# Altium schematic sheet USB.SchDoc
size A3; DocumentNumber: 16; SheetNumber: 18; SheetTotal: 19
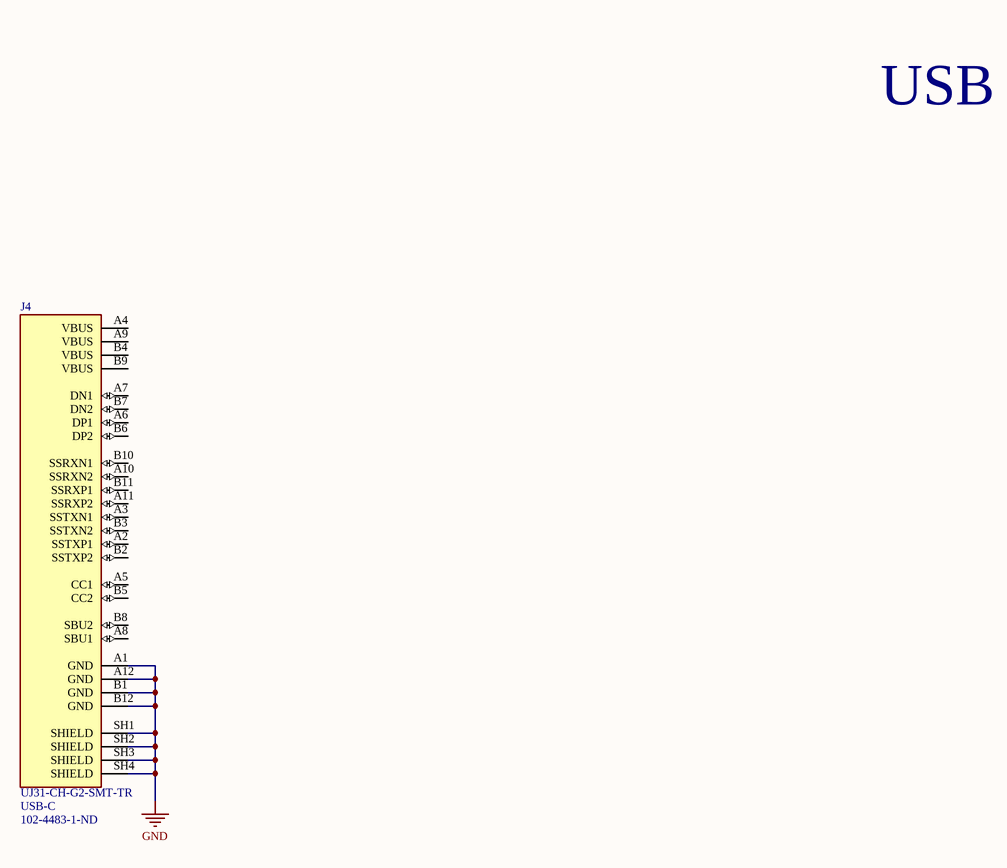
[diagram p0: USB.SchDoc]

## Parts
J4  UJ31-CH-G2-SMT-TR  Connector Type: USB-C  Supplier Part Number 1: 102-4483-1-ND  [UJ31-CH-G2-SMT-TR]

## Nets
GND: J4.A1(GND) J4.A12(GND) J4.B1(GND) J4.B12(GND) J4.SH1(SHIELD) J4.SH2(SHIELD) J4.SH3(SHIELD) J4.SH4(SHIELD)

Not connected (* = marked no-connect by the designer): J4 A2(SSTXP1) A3(SSTXN1) A4(VBUS) A5(CC1) A6(DP1) A7(DN1) A8(SBU1) A9(VBUS) A10(SSRXN2) A11(SSRXP2) B2(SSTXP2) B3(SSTXN2) B4(VBUS) B5(CC2) B6(DP2) B7(DN2) B8(SBU2) B9(VBUS) B10(SSRXN1) B11(SSRXP1)

## Notes on the sheet
- USB

## Library data of the parts
J4 = CONN_UJ31-CH-G2-SMT-TR: Type C, USB 3.1 Gen 2, 5 A, Right Angle, Surface Mount _SMT_, USB Receptacle; Mfr: CUI Devices; Number of Contacts: 24; Specifications: USB 3.2 Gen 2 (USB 3.1 Gen 2, Superspeed + (USB 3.1)); Current Rating: 6.25A; Voltage Rating: 20V; Operating Temperature: -25C - 80C; Digikey Part Number: 102-4483-1-ND; ComponentLink1Description: Digikey; ComponentLink1URL: https://www.digikey.ca/en/products/detail/cui-devices/UJ31-CH-G2-SMT-TR/8024057; Supplier 1: Digi-Key